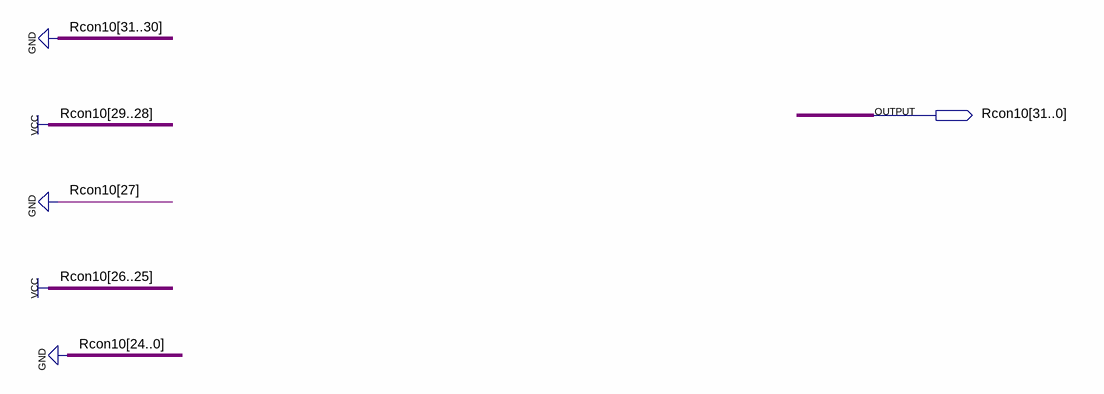
[diagram p0: schematic sheet]
// Quartus schematic Rcon10.bdf as structural Verilog: 0 symbols, 1 pins
module Rcon10 (
  output [31:0] Rcon10
);


  assign Rcon10 = 32'b00110110000000000000000000000000;
endmodule
